# Altium schematic sheet Sheet1.SchDoc
size A4; SheetNumber: 1; SheetTotal: 1
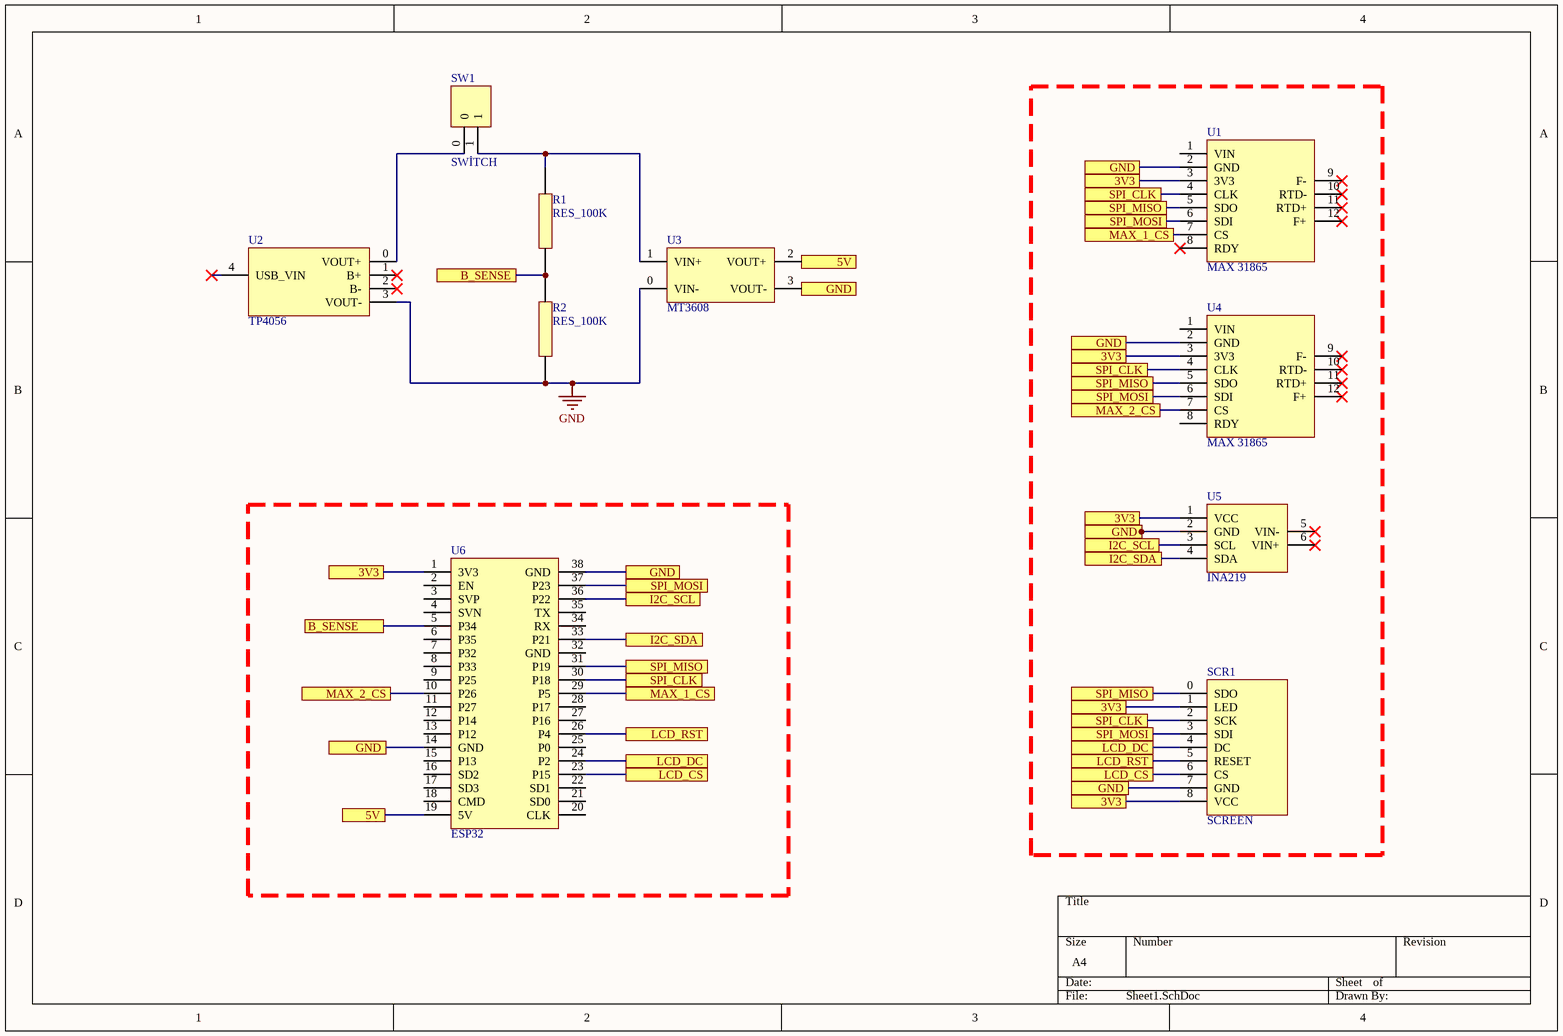
[diagram p0: Sheet1.SchDoc]

## Parts
R1  RES_100K  [RES]
R2  RES_100K  [RES]
SCR1  SCREEN  [LCD]
SW1  SWİTCH  [SWİTCH]
U1  MAX 31865  [MAX31865]
U2  TP4056  [TP4056]
U3  MT3608  [MT3608]
U4  MAX 31865  [MAX31865]
U5  INA219  [INA219]
U6  ESP32  [ESP32]

## Ports
3V3 (see Sheet1[1C], Sheet1[3A], Sheet1[3B], Sheet1[3C]), 3V3 (see Sheet1[1C], Sheet1[3A], Sheet1[3B], Sheet1[3C], Sheet1[3D]), 3V3 (see Sheet1[1C], Sheet1[3A], Sheet1[3C], Sheet1[3D]), 3V3 (see Sheet1[1C], Sheet1[3B], Sheet1[3C], Sheet1[3D]), 3V3 (see Sheet1[3A], Sheet1[3B], Sheet1[3C], Sheet1[3D]), 5V (see Sheet1[1D]), 5V (see Sheet1[3B]), B_SENSE (see Sheet1[1C]), B_SENSE (see Sheet1[2B]), GND (see Sheet1[1C], Sheet1[2C], Sheet1[3A], Sheet1[3B], Sheet1[3C]), GND (see Sheet1[1C], Sheet1[2C], Sheet1[3A], Sheet1[3B], Sheet1[3C], Sheet1[3D]), GND (see Sheet1[1C], Sheet1[2C], Sheet1[3A], Sheet1[3B], Sheet1[3D]), GND (see Sheet1[1C], Sheet1[2C], Sheet1[3B], Sheet1[3C], Sheet1[3D]), GND (see Sheet1[1C], Sheet1[3A], Sheet1[3B], Sheet1[3C], Sheet1[3D]), GND (see Sheet1[2C], Sheet1[3A], Sheet1[3B], Sheet1[3C], Sheet1[3D]), I2C_SCL (see Sheet1[2C]), I2C_SCL (see Sheet1[3C]), I2C_SDA (see Sheet1[2C]), I2C_SDA (see Sheet1[3C]), LCD_CS (see Sheet1[2D]), LCD_CS (see Sheet1[3D]), LCD_DC (see Sheet1[2C]), LCD_DC (see Sheet1[3C]), LCD_RST (see Sheet1[2C]), LCD_RST (see Sheet1[3C]), MAX_1_CS (see Sheet1[2C]), MAX_1_CS (see Sheet1[3A]), MAX_2_CS (see Sheet1[1C]), MAX_2_CS (see Sheet1[3B]), SPI_CLK (see Sheet1[2C], Sheet1[3A], Sheet1[3B]), SPI_CLK (see Sheet1[2C], Sheet1[3A], Sheet1[3C]), SPI_CLK (see Sheet1[2C], Sheet1[3B], Sheet1[3C]), SPI_CLK (see Sheet1[3A], Sheet1[3B], Sheet1[3C]), SPI_MISO (see Sheet1[2C], Sheet1[3A], Sheet1[3B]), SPI_MISO (see Sheet1[2C], Sheet1[3A], Sheet1[3C]), SPI_MISO (see Sheet1[2C], Sheet1[3B], Sheet1[3C]), SPI_MISO (see Sheet1[3A], Sheet1[3B], Sheet1[3C]), SPI_MOSI (see Sheet1[2C], Sheet1[3A], Sheet1[3B]), SPI_MOSI (see Sheet1[2C], Sheet1[3A], Sheet1[3C]), SPI_MOSI (see Sheet1[2C], Sheet1[3B], Sheet1[3C]), SPI_MOSI (see Sheet1[3A], Sheet1[3B], Sheet1[3C])

## Nets
GND: R2.1 U2.3(VOUT-) U3.0(VIN-)
3V3: SCR1.1(LED) SCR1.8(VCC) U1.3(3V3) U4.3(3V3) U5.1(VCC) U6.1(3V3) ; port 3V3
5V: U3.2(VOUT+) U6.19(5V) ; port 5V
B_SENSE: R1.1 R2.2 U6.5(P34) ; port B_SENSE
GND: SCR1.7(GND) U1.2(GND) U3.3(VOUT-) U4.2(GND) U5.2(GND) U6.14(GND) U6.38(GND) ; port GND  [a separate net that carries the same name]
I2C_SCL: U5.3(SCL) U6.36(P22) ; port I2C_SCL
I2C_SDA: U5.4(SDA) U6.33(P21) ; port I2C_SDA
LCD_CS: SCR1.6(CS) U6.23(P15) ; port LCD_CS
LCD_DC: SCR1.4(DC) U6.24(P2) ; port LCD_DC
LCD_RST: SCR1.5(RESET) U6.26(P4) ; port LCD_RST
MAX_1_CS: U1.7(CS) U6.29(P5) ; port MAX_1_CS
MAX_2_CS: U4.7(CS) U6.10(P26) ; port MAX_2_CS
SPI_CLK: SCR1.2(SCK) U1.4(CLK) U4.4(CLK) U6.30(P18) ; port SPI_CLK
SPI_MISO: SCR1.0(SDO) U1.5(SDO) U4.5(SDO) U6.31(P19) ; port SPI_MISO
SPI_MOSI: SCR1.3(SDI) U1.6(SDI) U4.6(SDI) U6.37(P23) ; port SPI_MOSI
NetR1_2: R1.2 SW1.1 U3.1(VIN+)
NetSW1_0: SW1.0 U2.0(VOUT+)

Not connected (* = marked no-connect by the designer): U1 1(VIN) 8(RDY)* 9(F-)* 10(RTD-)* 11(RTD+)* 12(F+)*; U2 1(B+)* 2(B-)* 4(USB_VIN)*; U4 1(VIN) 8(RDY) 9(F-)* 10(RTD-)* 11(RTD+)* 12(F+)*; U5 5(VIN-)* 6(VIN+)*; U6 2(EN) 3(SVP) 4(SVN) 6(P35) 7(P32) 8(P33) 9(P25) 11(P27) 12(P14) 13(P12) 15(P13) 16(SD2) 17(SD3) 18(CMD) 20(CLK) 21(SD0) 22(SD1) 25(P0) 27(P16) 28(P17) 32(GND) 34(RX) 35(TX)

## Library data of the parts
U1 U4 = MAX_31865
U5 = INA_219